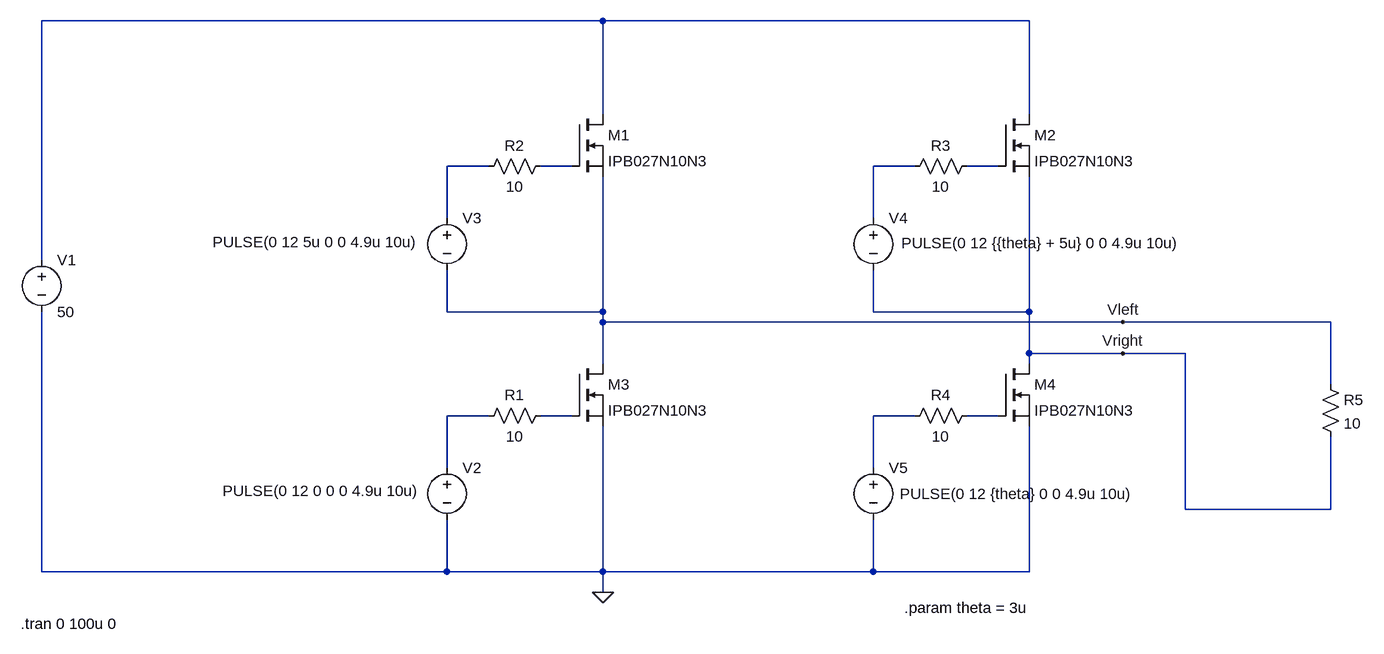
[diagram p0: schematic bridge_victor.asc]
bridge_victor.asc, the LTspice schematic file:
Version 4
SHEET 1 1384 864
WIRE 208 -80 -656 -80
WIRE 864 -80 208 -80
WIRE 208 64 208 -80
WIRE 864 64 864 -80
WIRE 32 144 -32 144
WIRE 160 144 112 144
WIRE 688 144 624 144
WIRE 816 144 768 144
WIRE -32 224 -32 144
WIRE 624 224 624 144
WIRE -656 288 -656 -80
WIRE -32 368 -32 304
WIRE 208 368 208 160
WIRE 208 368 -32 368
WIRE 624 368 624 304
WIRE 864 368 864 160
WIRE 864 368 624 368
WIRE 208 384 208 368
WIRE 1008 384 208 384
WIRE 1328 384 1008 384
WIRE 864 432 864 368
WIRE 1008 432 864 432
WIRE 1104 432 1008 432
WIRE 208 448 208 384
WIRE 864 448 864 432
WIRE 1328 480 1328 384
WIRE 32 528 -32 528
WIRE 160 528 112 528
WIRE 688 528 624 528
WIRE 816 528 768 528
WIRE -32 608 -32 528
WIRE 624 608 624 528
WIRE 1104 672 1104 432
WIRE 1328 672 1328 560
WIRE 1328 672 1104 672
WIRE -656 768 -656 368
WIRE -32 768 -32 688
WIRE -32 768 -656 768
WIRE 208 768 208 544
WIRE 208 768 -32 768
WIRE 624 768 624 688
WIRE 624 768 208 768
WIRE 864 768 864 544
WIRE 864 768 624 768
WIRE 208 800 208 768
FLAG 208 800 0
FLAG 1008 384 Vleft
FLAG 1008 432 Vright
SYMBOL nmos 160 64 R0
SYMATTR InstName M1
SYMATTR Value IPB027N10N3
SYMBOL voltage -656 272 R0
WINDOW 123 0 0 Left 0
WINDOW 39 0 0 Left 0
SYMATTR InstName V1
SYMATTR Value 50
SYMBOL voltage -32 592 R0
WINDOW 3 -345 52 Left 2
WINDOW 123 0 0 Left 0
WINDOW 39 0 0 Left 0
SYMATTR Value PULSE(0 12 0 0 0 4.9u 10u)
SYMATTR InstName V2
SYMBOL res 128 512 R90
WINDOW 0 0 56 VBottom 2
WINDOW 3 32 56 VTop 2
SYMATTR InstName R1
SYMATTR Value 10
SYMBOL voltage -32 208 R0
WINDOW 3 -361 53 Left 2
WINDOW 123 0 0 Left 0
WINDOW 39 0 0 Left 0
SYMATTR Value PULSE(0 12 5u 0 0 4.9u 10u)
SYMATTR InstName V3
SYMBOL res 128 128 R90
WINDOW 0 0 56 VBottom 2
WINDOW 3 32 56 VTop 2
SYMATTR InstName R2
SYMATTR Value 10
SYMBOL voltage 624 208 R0
WINDOW 3 43 54 Left 2
WINDOW 123 0 0 Left 0
WINDOW 39 0 0 Left 0
SYMATTR Value PULSE(0 12 {{theta} + 5u} 0 0 4.9u 10u)
SYMATTR InstName V4
SYMBOL res 784 128 R90
WINDOW 0 0 56 VBottom 2
WINDOW 3 32 56 VTop 2
SYMATTR InstName R3
SYMATTR Value 10
SYMBOL voltage 624 592 R0
WINDOW 3 41 56 Left 2
WINDOW 123 0 0 Left 0
WINDOW 39 0 0 Left 0
SYMATTR Value PULSE(0 12 {theta} 0 0 4.9u 10u)
SYMATTR InstName V5
SYMBOL res 784 512 R90
WINDOW 0 0 56 VBottom 2
WINDOW 3 32 56 VTop 2
SYMATTR InstName R4
SYMATTR Value 10
SYMBOL res 1312 464 R0
SYMATTR InstName R5
SYMATTR Value 10
SYMBOL nmos 816 64 R0
SYMATTR InstName M2
SYMATTR Value IPB027N10N3
SYMBOL nmos 160 448 R0
SYMATTR InstName M3
SYMATTR Value IPB027N10N3
SYMBOL nmos 816 448 R0
SYMATTR InstName M4
SYMATTR Value IPB027N10N3
TEXT 672 824 Left 2 !.param theta = 3u
TEXT -688 848 Left 2 !.tran 0 100u 0

The netlist it stands for:
* bridge_victor.asc
M1 N001 N003 Vleft Vleft IPB027N10N3
V1 N001 0 50
V2 N006 0 PULSE(0 12 0 0 0 4.9u 10u)
R1 N007 N006 10
V3 N002 Vleft PULSE(0 12 5u 0 0 4.9u 10u)
R2 N003 N002 10
V4 N004 Vright PULSE(0 12 {{theta} + 5u} 0 0 4.9u 10u)
R3 N005 N004 10
V5 N008 0 PULSE(0 12 {theta} 0 0 4.9u 10u)
R4 N009 N008 10
R5 Vleft Vright 10
M2 N001 N005 Vright Vright IPB027N10N3
M3 Vleft N007 0 0 IPB027N10N3
M4 Vright N009 0 0 IPB027N10N3
.model NMOS NMOS
.model PMOS PMOS
.lib standard.mos
.param theta = 3u
.tran 0 100u 0
.backanno
.end